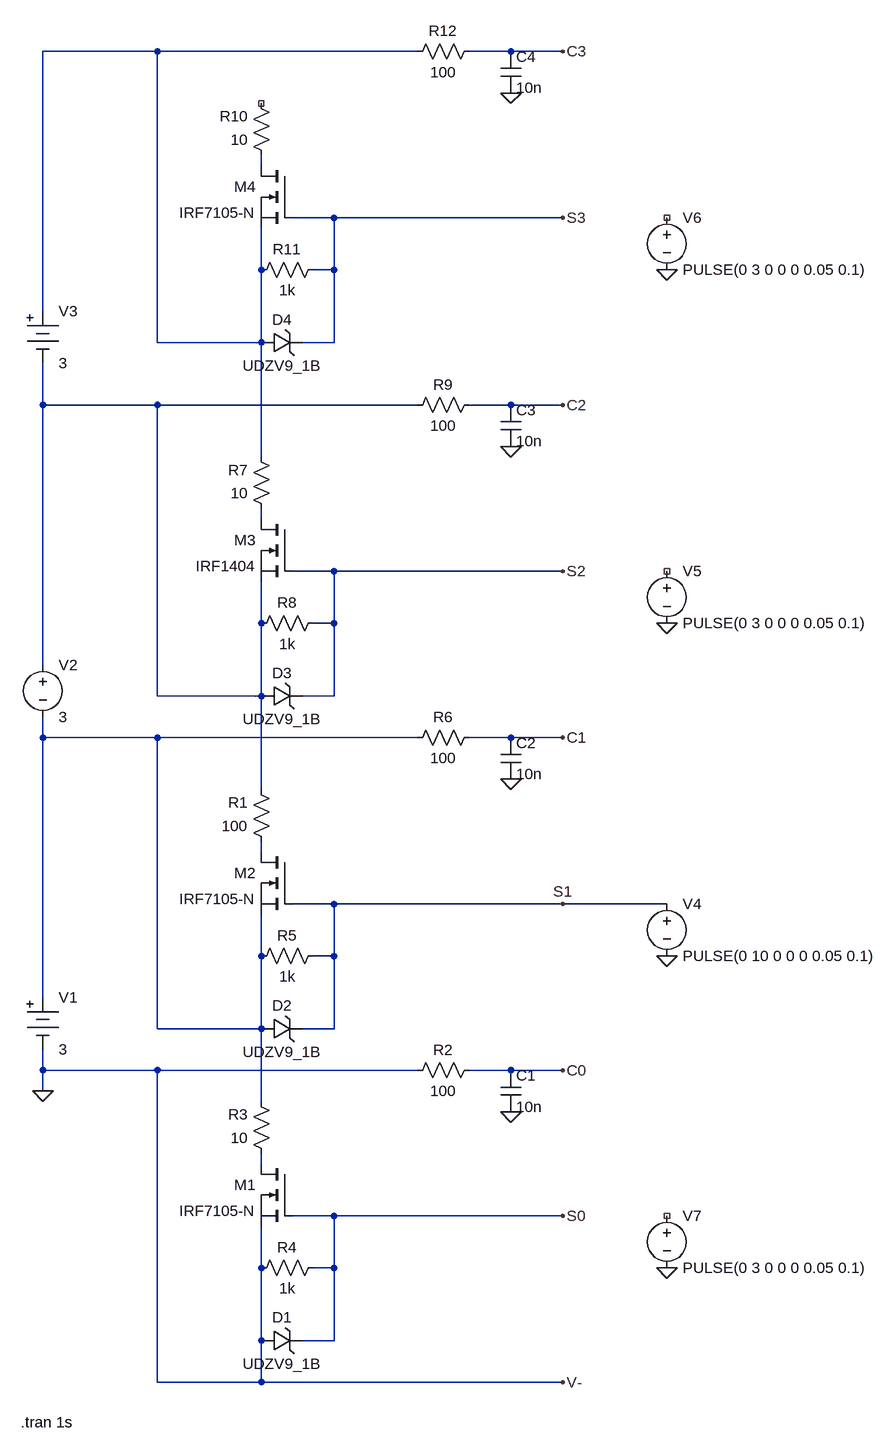
[diagram p0: schematic balancingCircuit.asc]
balancingCircuit.asc, the LTspice schematic file:
Version 4
SHEET 1 924 688
WIRE -272 -1440 -448 -1440
WIRE 128 -1440 -272 -1440
WIRE 272 -1440 208 -1440
WIRE 352 -1440 272 -1440
WIRE -112 -1264 -112 -1280
WIRE 0 -1184 -64 -1184
WIRE 352 -1184 0 -1184
WIRE -112 -1104 -112 -1168
WIRE 0 -1104 0 -1184
WIRE 0 -1104 -32 -1104
WIRE -448 -1040 -448 -1440
WIRE -272 -992 -272 -1440
WIRE -112 -992 -112 -1104
WIRE -112 -992 -272 -992
WIRE 0 -992 0 -1104
WIRE 0 -992 -48 -992
WIRE -448 -896 -448 -960
WIRE -272 -896 -448 -896
WIRE 128 -896 -272 -896
WIRE 272 -896 208 -896
WIRE 352 -896 272 -896
WIRE -112 -816 -112 -992
WIRE -112 -720 -112 -736
WIRE 0 -640 -64 -640
WIRE 352 -640 0 -640
WIRE -112 -560 -112 -624
WIRE 0 -560 0 -640
WIRE 0 -560 -32 -560
WIRE -448 -496 -448 -896
WIRE -272 -448 -272 -896
WIRE -112 -448 -112 -560
WIRE -112 -448 -272 -448
WIRE 0 -448 0 -560
WIRE 0 -448 -48 -448
WIRE -448 -384 -448 -416
WIRE -272 -384 -448 -384
WIRE 128 -384 -272 -384
WIRE 272 -384 208 -384
WIRE 352 -384 272 -384
WIRE -112 -304 -112 -448
WIRE -112 -208 -112 -224
WIRE 0 -128 -64 -128
WIRE 352 -128 0 -128
WIRE 512 -128 352 -128
WIRE -112 -48 -112 -112
WIRE 0 -48 0 -128
WIRE 0 -48 -32 -48
WIRE -448 16 -448 -384
WIRE -272 64 -272 -384
WIRE -112 64 -112 -48
WIRE -112 64 -272 64
WIRE 0 64 0 -48
WIRE 0 64 -48 64
WIRE -448 128 -448 96
WIRE -272 128 -448 128
WIRE 128 128 -272 128
WIRE 272 128 208 128
WIRE 352 128 272 128
WIRE -448 160 -448 128
WIRE -112 176 -112 64
WIRE -112 272 -112 256
WIRE 0 352 -64 352
WIRE 352 352 0 352
WIRE -112 432 -112 368
WIRE 0 432 0 352
WIRE 0 432 -32 432
WIRE -112 544 -112 432
WIRE 0 544 0 432
WIRE 0 544 -48 544
WIRE -272 608 -272 128
WIRE -112 608 -112 544
WIRE -112 608 -272 608
WIRE 352 608 -112 608
FLAG 272 192 0
FLAG 352 128 C0
FLAG 352 352 S0
FLAG -448 160 0
FLAG 352 608 V-
FLAG 352 -128 S1
FLAG 272 -320 0
FLAG 352 -384 C1
FLAG 352 -640 S2
FLAG 272 -832 0
FLAG 352 -896 C2
FLAG 352 -1184 S3
FLAG 272 -1376 0
FLAG 352 -1440 C3
FLAG 512 -48 0
FLAG 512 -560 0
FLAG 512 -1104 0
FLAG 512 432 0
SYMBOL Misc\\battery -448 0 R0
WINDOW 123 0 0 Left 0
WINDOW 39 0 0 Left 0
SYMATTR InstName V1
SYMATTR Value 3
SYMBOL nmos -64 272 M0
SYMATTR InstName M1
SYMATTR Value IRF7105-N
SYMBOL res 224 112 R90
WINDOW 0 0 56 VBottom 2
WINDOW 3 32 56 VTop 2
SYMATTR InstName R2
SYMATTR Value 100
SYMBOL cap 256 128 R0
SYMATTR InstName C1
SYMATTR Value 10n
SYMBOL res -96 272 R180
WINDOW 0 36 76 Left 2
WINDOW 3 36 40 Left 2
SYMATTR InstName R3
SYMATTR Value 10
SYMBOL zener -112 560 R270
WINDOW 0 36 32 VTop 2
WINDOW 3 -4 32 VBottom 2
SYMATTR InstName D1
SYMATTR Value UDZV9_1B
SYMBOL res -16 416 R90
WINDOW 0 0 56 VBottom 2
WINDOW 3 32 56 VTop 2
SYMATTR InstName R4
SYMATTR Value 1k
SYMBOL nmos -64 -208 M0
SYMATTR InstName M2
SYMATTR Value IRF7105-N
SYMBOL res -96 -208 R180
WINDOW 0 36 76 Left 2
WINDOW 3 36 40 Left 2
SYMATTR InstName R1
SYMATTR Value 100
SYMBOL zener -112 80 R270
WINDOW 0 36 32 VTop 2
WINDOW 3 -4 32 VBottom 2
SYMATTR InstName D2
SYMATTR Value UDZV9_1B
SYMBOL res -16 -64 R90
WINDOW 0 0 56 VBottom 2
WINDOW 3 32 56 VTop 2
SYMATTR InstName R5
SYMATTR Value 1k
SYMBOL res 224 -400 R90
WINDOW 0 0 56 VBottom 2
WINDOW 3 32 56 VTop 2
SYMATTR InstName R6
SYMATTR Value 100
SYMBOL cap 256 -384 R0
SYMATTR InstName C2
SYMATTR Value 10n
SYMBOL nmos -64 -720 M0
SYMATTR InstName M3
SYMATTR Value IRF1404
SYMBOL res -96 -720 R180
WINDOW 0 36 76 Left 2
WINDOW 3 36 40 Left 2
SYMATTR InstName R7
SYMATTR Value 10
SYMBOL zener -112 -432 R270
WINDOW 0 36 32 VTop 2
WINDOW 3 -4 32 VBottom 2
SYMATTR InstName D3
SYMATTR Value UDZV9_1B
SYMBOL res -16 -576 R90
WINDOW 0 0 56 VBottom 2
WINDOW 3 32 56 VTop 2
SYMATTR InstName R8
SYMATTR Value 1k
SYMBOL res 224 -912 R90
WINDOW 0 0 56 VBottom 2
WINDOW 3 32 56 VTop 2
SYMATTR InstName R9
SYMATTR Value 100
SYMBOL cap 256 -896 R0
SYMATTR InstName C3
SYMATTR Value 10n
SYMBOL Misc\\battery -448 -1056 R0
WINDOW 123 0 0 Left 0
WINDOW 39 0 0 Left 0
SYMATTR InstName V3
SYMATTR Value 3
SYMBOL nmos -64 -1264 M0
SYMATTR InstName M4
SYMATTR Value IRF7105-N
SYMBOL res -96 -1264 R180
WINDOW 0 36 76 Left 2
WINDOW 3 36 40 Left 2
SYMATTR InstName R10
SYMATTR Value 10
SYMBOL zener -112 -976 R270
WINDOW 0 36 32 VTop 2
WINDOW 3 -4 32 VBottom 2
SYMATTR InstName D4
SYMATTR Value UDZV9_1B
SYMBOL res -16 -1120 R90
WINDOW 0 0 56 VBottom 2
WINDOW 3 32 56 VTop 2
SYMATTR InstName R11
SYMATTR Value 1k
SYMBOL res 224 -1456 R90
WINDOW 0 0 56 VBottom 2
WINDOW 3 32 56 VTop 2
SYMATTR InstName R12
SYMATTR Value 100
SYMBOL cap 256 -1440 R0
SYMATTR InstName C4
SYMATTR Value 10n
SYMBOL voltage 512 -144 R0
WINDOW 123 0 0 Left 0
WINDOW 39 0 0 Left 0
SYMATTR InstName V4
SYMATTR Value PULSE(0 10 0 0 0 0.05 0.1)
SYMBOL voltage 512 -656 R0
WINDOW 123 0 0 Left 0
WINDOW 39 0 0 Left 0
SYMATTR InstName V5
SYMATTR Value PULSE(0 3 0 0 0 0.05 0.1)
SYMBOL voltage 512 -1200 R0
WINDOW 123 0 0 Left 0
WINDOW 39 0 0 Left 0
SYMATTR InstName V6
SYMATTR Value PULSE(0 3 0 0 0 0.05 0.1)
SYMBOL voltage 512 336 R0
WINDOW 123 0 0 Left 0
WINDOW 39 0 0 Left 0
SYMATTR InstName V7
SYMATTR Value PULSE(0 3 0 0 0 0.05 0.1)
SYMBOL voltage -448 -512 R0
WINDOW 123 0 0 Left 0
WINDOW 39 0 0 Left 0
SYMATTR InstName V2
SYMATTR Value 3
TEXT -482 670 Left 2 !.tran 1s

The netlist it stands for:
* balancingCircuit.asc
V1 N005 0 3
M1 N007 S0 0 0 IRF7105-N
R2 C0 0 100
C1 C0 0 10n
R3 N007 N005 10
D1 0 S0 UDZV9_1B
R4 S0 0 1k
M2 N006 S1 N005 N005 IRF7105-N
R1 N006 N003 100
D2 N005 S1 UDZV9_1B
R5 S1 N005 1k
R6 C1 N005 100
C2 C1 0 10n
M3 N004 S2 N003 N003 IRF1404
R7 N004 N001 10
D3 N003 S2 UDZV9_1B
R8 S2 N003 1k
R9 C2 N003 100
C3 C2 0 10n
V3 N001 N003 3
M4 N002 S3 N001 N001 IRF7105-N
R10 N002 NC_01 10
D4 N001 S3 UDZV9_1B
R11 S3 N001 1k
R12 C3 N001 100
C4 C3 0 10n
V4 S1 0 PULSE(0 10 0 0 0 0.05 0.1)
V5 NC_02 0 PULSE(0 3 0 0 0 0.05 0.1)
V6 NC_03 0 PULSE(0 3 0 0 0 0.05 0.1)
V7 NC_04 0 PULSE(0 3 0 0 0 0.05 0.1)
V2 N003 N005 3
.model D D
.lib standard.dio
.model NMOS NMOS
.model PMOS PMOS
.lib standard.mos
.tran 1s
.backanno
.end